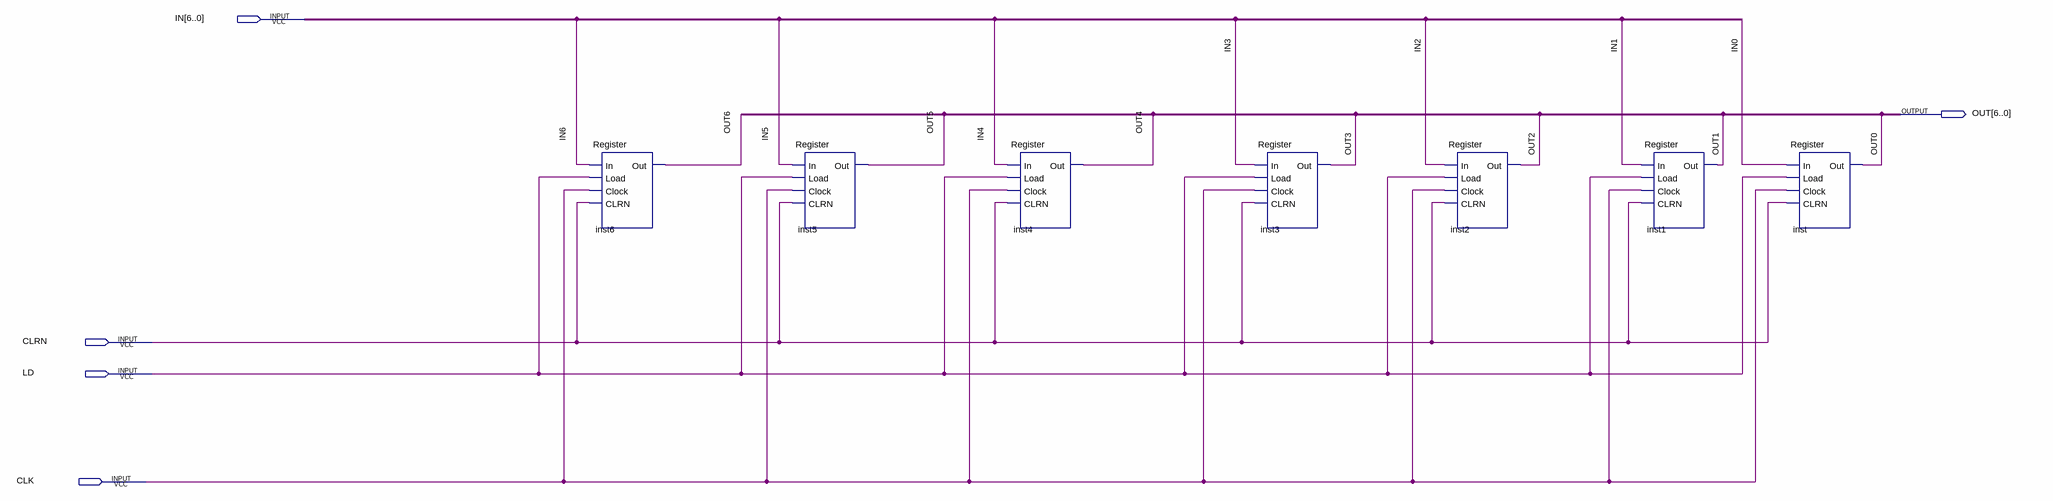
[diagram p0: schematic sheet]
// Quartus schematic reg7b.bdf as structural Verilog: 7 symbols, 5 pins
module reg7b (
  input  [6:0] IN,
  input  CLRN,
  input  LD,
  input  CLK,
  output [6:0] OUT
);

  Register inst6 (.In(IN[6]), .Load(LD), .Clock(CLK), .CLRN(CLRN), .Out(OUT[6]));
  Register inst5 (.In(IN[5]), .Load(LD), .Clock(CLK), .CLRN(CLRN), .Out(OUT[5]));
  Register inst4 (.In(IN[4]), .Load(LD), .Clock(CLK), .CLRN(CLRN), .Out(OUT[4]));
  Register inst3 (.In(IN[3]), .Load(LD), .Clock(CLK), .CLRN(CLRN), .Out(OUT[3]));
  Register inst2 (.In(IN[2]), .Load(LD), .Clock(CLK), .CLRN(CLRN), .Out(OUT[2]));
  Register inst1 (.In(IN[1]), .Load(LD), .Clock(CLK), .CLRN(CLRN), .Out(OUT[1]));
  Register inst (.In(IN[0]), .Load(LD), .Clock(CLK), .CLRN(CLRN), .Out(OUT[0]));
endmodule
